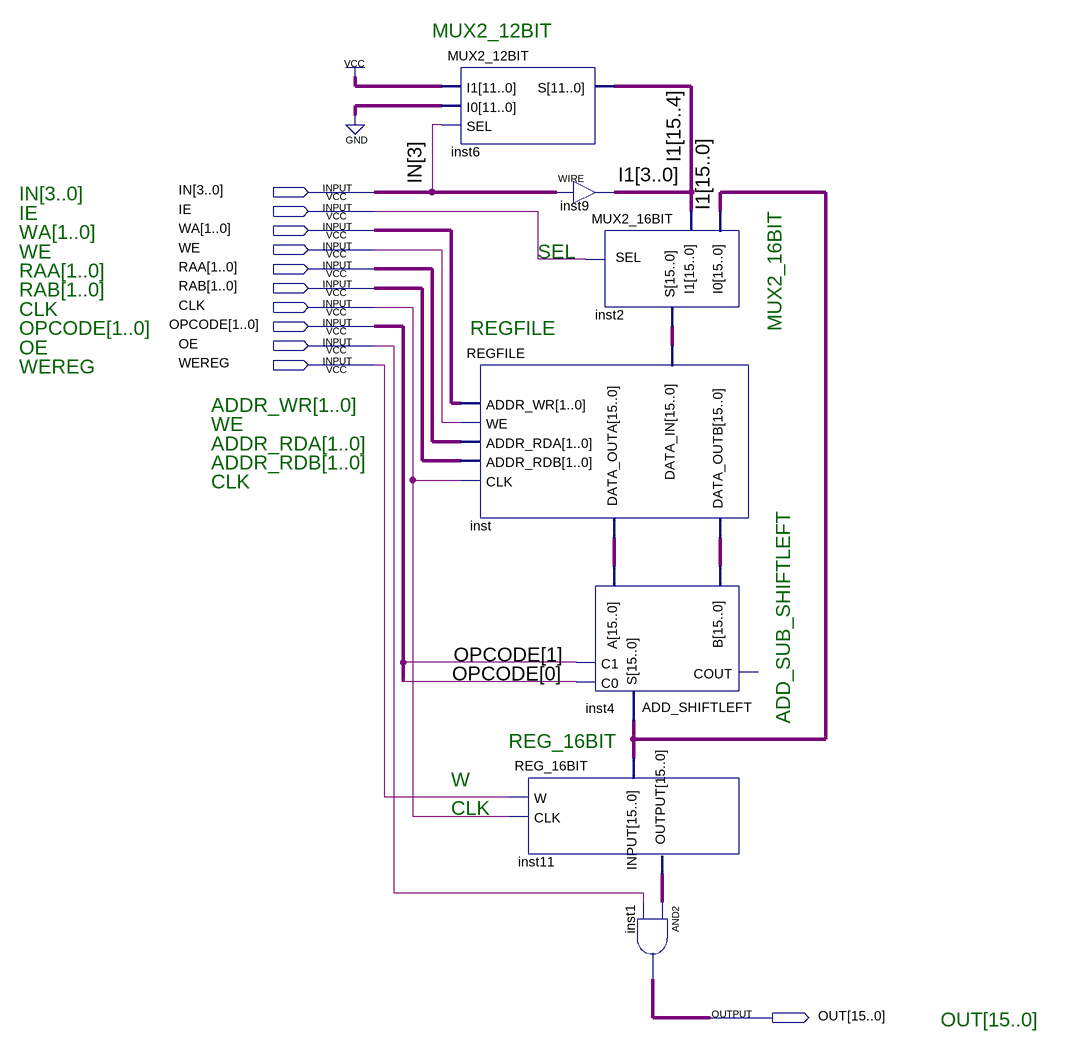
[diagram p0: schematic sheet]
// Quartus schematic DATAPATH.bdf as structural Verilog: 7 symbols, 11 pins
module DATAPATH (
  input  [3:0] IN,
  input  IE,
  input  [1:0] WA,
  input  WE,
  input  [1:0] RAA,
  input  [1:0] RAB,
  input  CLK,
  input  [1:0] OPCODE,
  input  OE,
  input  WEREG,
  output [15:0] OUT
);

  wire [15:0] I1, inst2_s, inst4_s, inst11_output, inst_data_outa, inst_data_outb;

  MUX2_12BIT inst6 (.I1({12{1'b1}}), .I0({12{1'b0}}), .SEL(IN[3]), .S(I1[15:4]));
  REGFILE inst (
    .DATA_IN(inst2_s), .ADDR_WR(WA), .WE(WE), .ADDR_RDA(RAA), .ADDR_RDB(RAB), .CLK(CLK),
    .DATA_OUTA(inst_data_outa), .DATA_OUTB(inst_data_outb));
  REG_16BIT inst11 (.W(WEREG), .INPUT(inst4_s), .CLK(CLK), .OUTPUT(inst11_output));
  assign I1[3:0] = IN;  // WIRE inst9
  MUX2_16BIT inst2 (.I1(I1), .I0(inst4_s), .SEL(IE), .S(inst2_s));
  ADD_SHIFTLEFT inst4 (
    .A(inst_data_outa), .B(inst_data_outb), .C1(OPCODE[1]), .C0(OPCODE[0]), .S(inst4_s));  // open: COUT
  assign OUT = inst11_output & {16{OE}};  // AND2 inst1, 16 bits wide

  // Notes on the sheet:
  //   MUX2_12BIT
  //   IN[3..0]
  //   MUX2_16BIT
  //   IE
  //   WA[1..0]
  //   WE
  //   SEL
  //   RAA[1..0]
  //   RAB[1..0]
  //   CLK
  //   OPCODE[1..0]
  //   REGFILE
  //   OE
  //   WEREG
  //   ADDR_WR[1..0]
  //   WE
  //   ADDR_RDA[1..0]
  //   ADDR_RDB[1..0]
  //   ADD_SUB_SHIFTLEFT
  //   CLK
  //   REG_16BIT
  //   W
  //   CLK
  //   OUT[15..0]
endmodule
